# EAGLE design SOIC14 (EAGLE 6.0)
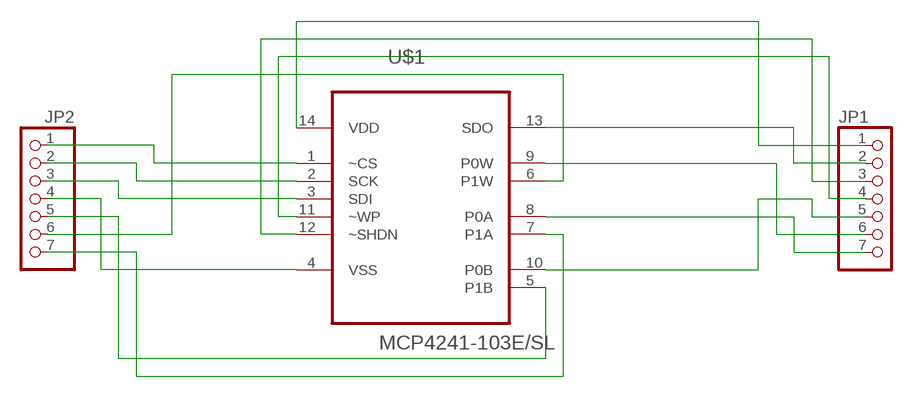
[diagram p0: schematic, sheet 1]

## Parts
JP1  PINHD-1X7  [1X07]
JP2  PINHD-1X7  [1X07]
U$1  MCP4241-103E/SL  [SOIC127P600X175-14N]

## Nets
N$1: JP2.1 U$1.1(~CS)
N$2: JP2.2 U$1.2(SCK)
N$3: JP2.3 U$1.3(SDI)
N$4: JP2.4 U$1.4(VSS)
N$5: JP2.5 U$1.5(P1B)
N$6: JP2.6 U$1.6(P1W)
N$7: JP2.7 U$1.7(P1A)
N$8: JP1.7 U$1.8(P0A)
N$9: JP1.6 U$1.9(P0W)
N$10: JP1.5 U$1.10(P0B)
N$11: JP1.4 U$1.11(~WP)
N$13: JP1.3 U$1.12(~SHDN)
N$14: JP1.2 U$1.13(SDO)
N$15: JP1.1 U$1.14(VDD)

## Library data of the parts
JP1 JP2 = pinhead:PINHD-1X7: PIN HEADER
U$1 = Microchip-MCP4241-103E_SL:MCP4241-103E/SL: Digital POT; MPN: MCP4241-103E/SL; OC_FARNELL: 1578440; OC_NEWARK: 08N6508; PACKAGE: SOIC-14; SUPPLIER: Microchip

## Board
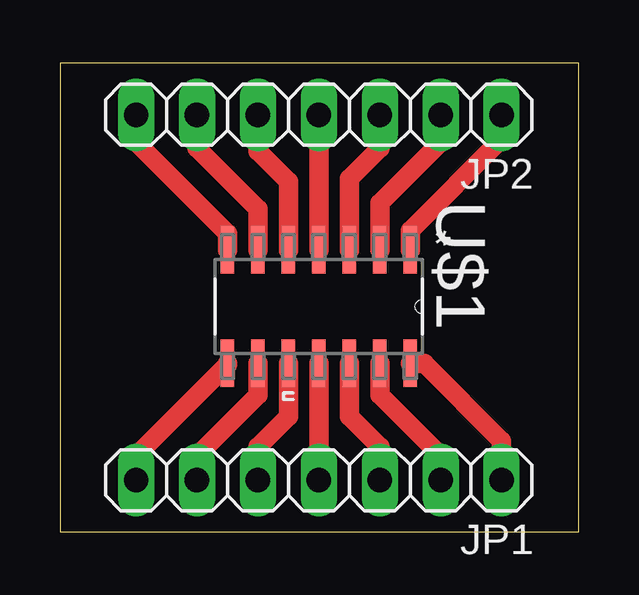
[diagram p1: board, top side]

Size 21.64 x 19.55 mm. Coordinates in mm from the lower left corner, seen from the top.
Outline: 0,0 21.64,0 21.64,19.55 0,19.55 0,0
Copper layers (1*16): Top 0.035mm / dielectric 1.5mm / Bottom 0.035mm
Design rules: minimum track width 10mil, minimum drill 24mil, track to track 8mil, track to pad 8mil, pad to pad 8mil, via to via 8mil, smd to smd 8mil, copper to edge 40mil, drill to drill 8mil, minimum pad ring 10mil, minimum via ring 8mil, stop-mask expansion 4mil, vias tented up to drill 0mil, thermal gap 10mil

### Footprints (pad centres in the part's own frame; a part is rotated, then mirrored left to right if it is on the bottom)
1X07 = drill 1.016 long: 1 -7.62,0; 2 -5.08,0; 3 -2.54,0; 4 0,0; 5 2.54,0; 6 5.08,0; 7 7.62,0
SOIC127P600X175-14N = smd 1.981 x 0.559: 1 -2.362,3.81; 2 -2.362,2.54; 3 -2.362,1.27; 4 -2.362,0; 5 -2.362,-1.27; 6 -2.362,-2.54; 7 -2.362,-3.81; 8 2.362,-3.81; 9 2.362,-2.54; 10 2.362,-1.27; 11 2.362,0; 12 2.362,1.27; 13 2.362,2.54; 14 2.362,3.81

### Placement (x,y rotation side)
JP1  10.79,2.16 180 top
JP2  10.79,17.4 180 top
U$1  10.79,9.4 270 top

### Tracks (layer width: path | path; a pad name or v marks a point on that pad's centre or on a via)
N$1
  Top 0.813: U$1.1 14.61,12.57 18.41,16.38 JP2.1
N$2
  Top 0.813: JP2.2 15.88,16.26 13.34,13.72 U$1.2
N$3
  Top 0.813: U$1.3 12.06,14.73 13.34,16 JP2.3
N$4
  Top 0.813: U$1.4 JP2.4
N$5
  Top 0.813: U$1.5 9.53,14.61 8.26,15.88 JP2.5
N$6
  Top 0.813: U$1.6 8.26,13.46 5.71,16 JP2.6
N$7
  Top 0.813: JP2.7 3.17,16.26 6.99,12.45 U$1.7
N$8
  Top 0.813: U$1.8 6.99,6.99 3.17,3.17 JP1.7
N$9
  Top 0.813: JP1.6 5.71,3.17 8.26,5.71 U$1.9
N$10
  Top 0.813: U$1.10 9.53,4.83 8.26,3.56 JP1.5
N$11
  Top 0.813: U$1.11 JP1.4
N$13
  Top 0.813: JP1.3 13.34,3.56 12.06,4.83 U$1.12
N$14
  Top 0.813: U$1.13 13.34,5.71 15.88,3.17 JP1.2
N$15
  Top 0.813: U$1.14 15.19,7.04 18.41,3.81 JP1.1